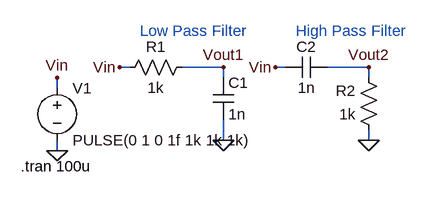
[diagram p0: schematic Passive RC Filters.asc]
Passive RC Filters.asc, the LTspice schematic file:
Version 4
SHEET 1 880 680
WIRE 16 96 0 96
WIRE 160 96 96 96
WIRE 256 96 240 96
WIRE 384 96 320 96
WIRE 160 112 160 96
WIRE 384 112 384 96
WIRE -96 128 -96 112
WIRE 160 208 160 176
WIRE 384 208 384 192
WIRE -96 224 -96 208
FLAG -96 224 0
FLAG 160 208 0
FLAG -96 112 Vin
FLAG 160 96 Vout1
FLAG 0 96 Vin
FLAG 384 208 0
FLAG 384 96 Vout2
FLAG 240 96 Vin
SYMBOL res 112 80 R90
WINDOW 0 0 56 VBottom 2
WINDOW 3 32 56 VTop 2
SYMATTR InstName R1
SYMATTR Value 1k
SYMBOL cap 144 112 R0
SYMATTR InstName C1
SYMATTR Value 1n
SYMBOL res 400 208 R180
WINDOW 0 36 76 Left 2
WINDOW 3 36 40 Left 2
SYMATTR InstName R2
SYMATTR Value 1k
SYMBOL cap 320 80 R90
WINDOW 0 0 32 VBottom 2
WINDOW 3 32 32 VTop 2
SYMATTR InstName C2
SYMATTR Value 1n
SYMBOL voltage -96 112 R0
WINDOW 123 0 0 Left 2
WINDOW 39 0 0 Left 2
SYMATTR InstName V1
SYMATTR Value PULSE(0 1 0 1f 1k 1k 1k)
TEXT -152 248 Left 2 !.tran 100u
TEXT 32 40 Left 2 ;Low Pass Filter
TEXT 272 40 Left 2 ;High Pass Filter

The netlist it stands for:
* Passive RC Filters.asc
R1 Vout1 Vin 1k
C1 Vout1 0 1n
R2 0 Vout2 1k
C2 Vout2 Vin 1n
V1 Vin 0 PULSE(0 1 0 1f 1k 1k 1k)
.tran 100u
* Low Pass Filter
* High Pass Filter
.backanno
.end